# Altium schematic sheet sensorMesh_nano.SchDoc
size A
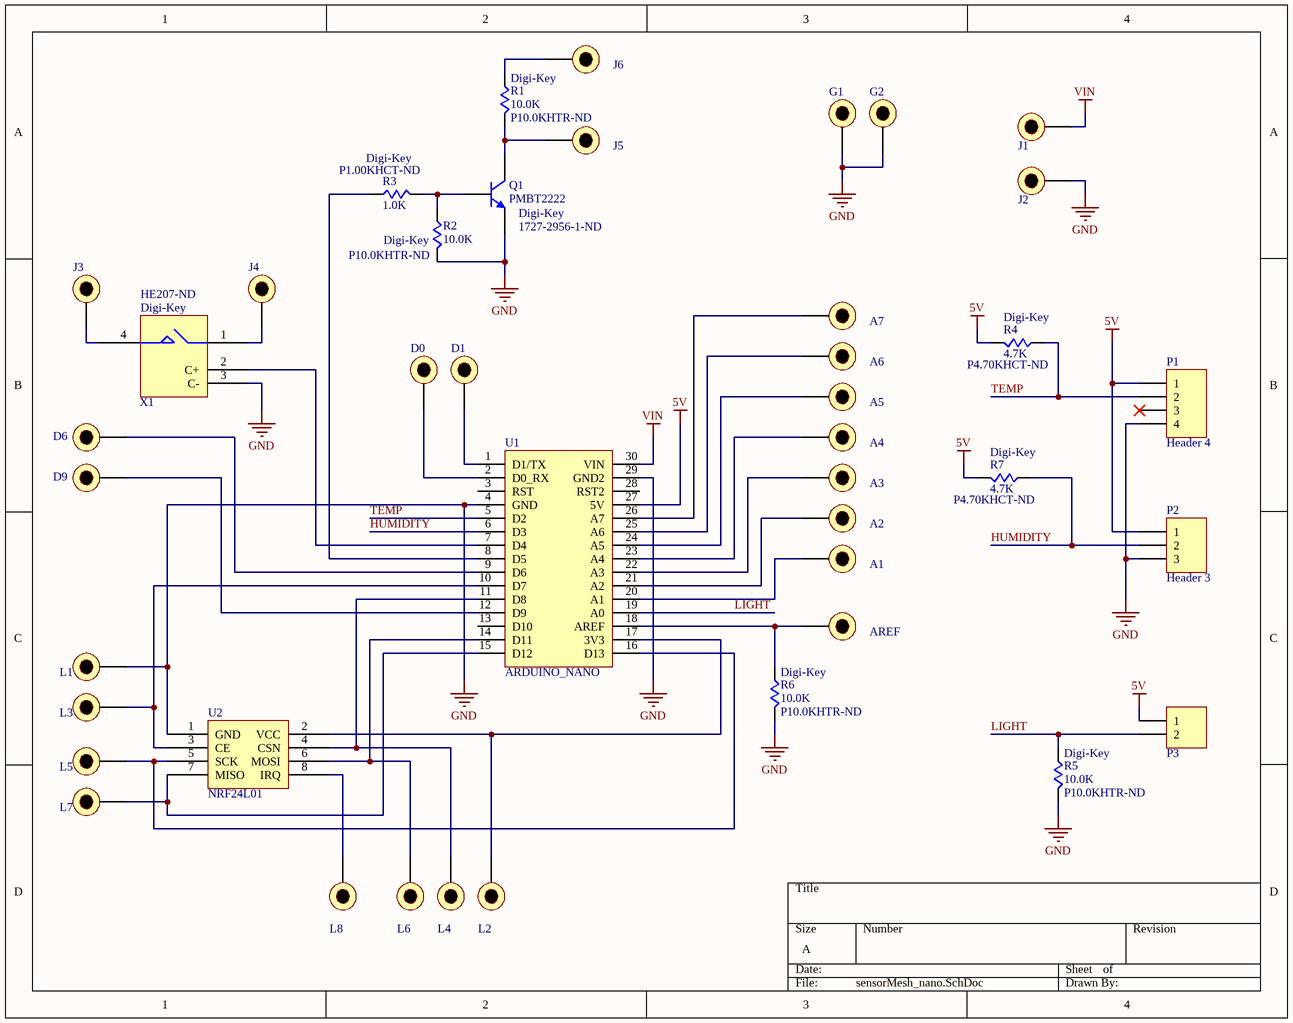
[diagram p0: sensorMesh_nano.SchDoc]

## Parts
A1  WIRE_HOLE  [20awg-wire]  (value not drawn)
A2  WIRE_HOLE  [20awg-wire]  (value not drawn)
A3  WIRE_HOLE  [20awg-wire]  (value not drawn)
A4  WIRE_HOLE  [20awg-wire]  (value not drawn)
A5  WIRE_HOLE  [20awg-wire]  (value not drawn)
A6  WIRE_HOLE  [20awg-wire]  (value not drawn)
A7  WIRE_HOLE  [20awg-wire]  (value not drawn)
AREF  WIRE_HOLE  [20awg-wire]  (value not drawn)
D0  WIRE_HOLE  [20awg-wire]  (value not drawn)
D1  WIRE_HOLE  [20awg-wire]  (value not drawn)
D6  WIRE_HOLE  [20awg-wire]  (value not drawn)
D9  WIRE_HOLE  [20awg-wire]  (value not drawn)
G1  WIRE_HOLE  [20awg-wire]  (value not drawn)
G2  WIRE_HOLE  [20awg-wire]  (value not drawn)
J1  WIRE_HOLE  [18awg-wire]  (value not drawn)
J2  WIRE_HOLE  [18awg-wire]  (value not drawn)
J3  WIRE_HOLE  [20awg-wire]  (value not drawn)
J4  WIRE_HOLE  [20awg-wire]  (value not drawn)
J5  WIRE_HOLE  [20awg-wire]  (value not drawn)
J6  WIRE_HOLE  [20awg-wire]  (value not drawn)
L1  WIRE_HOLE  [24awg-wire - ROUND]  (value not drawn)
L2  WIRE_HOLE  [24awg-wire - ROUND]  (value not drawn)
L3  WIRE_HOLE  [24awg-wire - ROUND]  (value not drawn)
L4  WIRE_HOLE  [24awg-wire - ROUND]  (value not drawn)
L5  WIRE_HOLE  [24awg-wire - ROUND]  (value not drawn)
L6  WIRE_HOLE  [24awg-wire - ROUND]  (value not drawn)
L7  WIRE_HOLE  [24awg-wire - ROUND]  (value not drawn)
L8  WIRE_HOLE  [24awg-wire - ROUND]  (value not drawn)
P1  Header 4  [HDR1X4]
P2  Header 3  [HDR1X3]
P3  Header 2  [HDR1X2]  (value not drawn)
Q1  Supplier 1: Digi-Key  Supplier Part Number 1: 1727-2956-1-ND  [SOT23_N]  (hidden comment: PMBT2222)
R1  value 10.0K  Supplier 1: Digi-Key  Supplier Part Number 1: P10.0KHTR-ND  [RESC1005N]  (hidden comment: R)
R2  value 10.0K  Supplier 1: Digi-Key  Supplier Part Number 1: P10.0KHTR-ND  [RESC1005N]  (hidden comment: R)
R3  value 1.0K  Supplier 1: Digi-Key  Supplier Part Number 1: P1.00KHCT-ND  [RESC1005N]  (hidden comment: R)
R4  value 4.7K  Supplier 1: Digi-Key  Supplier Part Number 1: P4.70KHCT-ND  [RESC1005N]  (hidden comment: R)
R5  value 10.0K  Supplier 1: Digi-Key  Supplier Part Number 1: P10.0KHTR-ND  [RESC1005N]  (hidden comment: R)
R6  value 10.0K  Supplier 1: Digi-Key  Supplier Part Number 1: P10.0KHTR-ND  [RESC1005N]  (hidden comment: R)
R7  value 4.7K  Supplier 1: Digi-Key  Supplier Part Number 1: P4.70KHCT-ND  [RESC1005N]  (hidden comment: R)
U1  ARDUINO_NANO  [ARDUINO_NANO]
U2  NRF24L01  [NRF24L01]
X1  Supplier 1: Digi-Key  Supplier Part Number 1: HE207-ND  [HE3600]  (hidden comment: REED_RELAY)

## Nets
5V: P1.1 P2.1 P3.1 R4.2 R7.2 U1.27(5V)
GND: G1.1 G2.1 J2.1 L1.1 P1.4 P2.3 Q1.2(E) R2.2 R5.2 R6.2 U1.4(GND) U1.29(GND2) U2.1(GND) X1.3(C-)
VIN: J1.1 U1.30(VIN)
HUMIDITY: P2.2 R7.1 U1.6(D3)
LIGHT: P3.2 R5.1 U1.19(A0)
TEMP: P1.2 R4.1 U1.5(D2)
NetA1_1: A1.1 U1.20(A1)
NetA2_1: A2.1 U1.21(A2)
NetA3_1: A3.1 U1.22(A3)
NetA4_1: A4.1 U1.23(A4)
NetA5_1: A5.1 U1.24(A5)
NetA6_1: A6.1 U1.25(A6)
NetA7_1: A7.1 U1.26(A7)
NetAREF_1: AREF.1 R6.1 U1.18(AREF)
NetD0_1: D0.1 U1.2(D0_RX)
NetD1_1: D1.1 U1.1(D1/TX)
NetD6_1: D6.1 U1.9(D6)
NetD9_1: D9.1 U1.12(D9)
NetJ3_1: J3.1 X1.4(SW2)
NetJ4_1: J4.1 X1.1(SW1)
NetJ5_1: J5.1 Q1.3(C) R1.2
NetJ6_1: J6.1 R1.1
NetL2_1: L2.1 U1.17(3V3) U2.2(VCC)
NetL3_1: L3.1 U1.10(D7) U2.3(CE)
NetL4_1: L4.1 U1.11(D8) U2.4(CSN)
NetL5_1: L5.1 U1.16(D13) U2.5(SCK)
NetL6_1: L6.1 U1.14(D11) U2.6(MOSI)
NetL7_1: L7.1 U1.15(D12) U2.7(MISO)
NetL8_1: L8.1 U2.8(IRQ)
NetQ1_1: Q1.1(B) R2.1 R3.2
NetR3_1: R3.1 U1.8(D5)
NetU1_7: U1.7(D4) X1.2(C+)

Not connected (* = marked no-connect by the designer): P1 3*; U1 3(RST) 13(D10) 28(RST2)

## Library data of the parts
P1 = Header 4: Header, 4-Pin; LatestRevisionDate: 17-Jul-2002; LatestRevisionNote: Re-released for DXP Platform.; Publisher: Altium Limited
P2 = Header 3: Header, 3-Pin; LatestRevisionDate: 17-Jul-2002; LatestRevisionNote: Re-released for DXP Platform.; Publisher: Altium Limited
P3 = Header 2: CONN HEADER 2POS .100" STR GOLD; Manufacturer Part Number 1: 0901200762; Manufacturer 1: Molex Inc; Substitution Allowed ?: Yes; Supplier 1: Digi-Key; Supplier 1 Part Number: WM8084-ND; Description 1: CONN HEADER 2POS .100" STR GOLD
Q1 = NPN: NPN Switching Transistor; Manufacturer 1: *; Manufacturer Part Number 1: *; Value: PMBT2222
R1-R7 = R: Resistor; Manufacturer 1: *; Manufacturer Part Number 1: *
U1 = Arduino_Nano: ARDUINO NANO MODULE